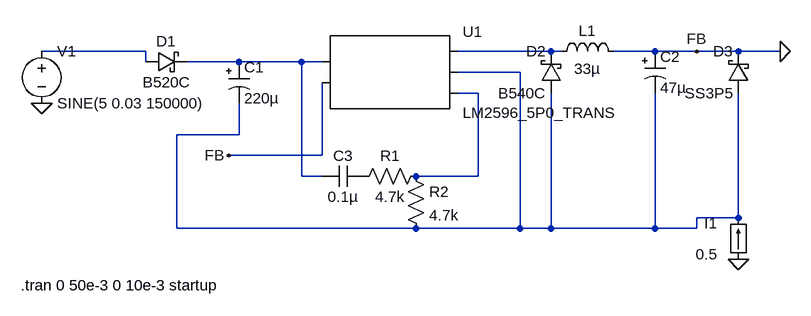
[diagram p0: schematic LM2596-N5.asc]
LM2596-N5.asc, the LTspice schematic file:
Version 4
SHEET 1 904 680
WIRE -176 128 -336 128
WIRE 448 128 304 128
WIRE 464 128 448 128
WIRE 608 128 544 128
WIRE 672 128 608 128
WIRE 736 128 672 128
WIRE 800 128 736 128
WIRE -176 144 -176 128
WIRE -32 144 -112 144
WIRE 64 144 -32 144
WIRE 96 144 64 144
WIRE -32 160 -32 144
WIRE 400 160 304 160
WIRE 336 192 304 192
WIRE -32 256 -32 208
WIRE -32 256 -128 256
WIRE 96 288 96 176
WIRE 96 288 -48 288
WIRE 64 320 64 144
WIRE 96 320 64 320
WIRE 336 320 336 192
WIRE 336 320 240 320
WIRE 736 384 736 192
WIRE 736 384 672 384
WIRE -128 400 -128 256
WIRE 240 400 -128 400
WIRE 400 400 400 160
WIRE 400 400 240 400
WIRE 448 400 448 192
WIRE 448 400 400 400
WIRE 608 400 608 192
WIRE 608 400 448 400
WIRE 672 400 672 384
WIRE 672 400 608 400
FLAG -336 208 0
FLAG 672 128 FB
FLAG -48 288 FB
FLAG 800 128 0
FLAG 736 448 0
SYMBOL AutoGenerated\\LM2596_5P0_TRANS 192 160 R0
SYMATTR InstName U1
SYMBOL voltage -336 112 R0
WINDOW 123 0 0 Left 2
WINDOW 39 0 0 Left 2
SYMATTR InstName V1
SYMATTR Value SINE(5 0.03 150000)
SYMBOL polcap -48 144 R0
WINDOW 3 24 56 Left 2
SYMATTR Value 220µ
SYMATTR InstName C1
SYMATTR Description Capacitor
SYMATTR Type cap
SYMATTR SpiceLine V=35 Irms=1.87845 Rser=0.07 Lser=0
SYMBOL ind 448 144 R270
WINDOW 0 32 56 VTop 2
WINDOW 3 5 56 VBottom 2
SYMATTR InstName L1
SYMATTR Value 33µ
SYMATTR SpiceLine Ipk=3.1 Rser=0.09 Rpar=29488.4 Cpar=0 mfg="Bourns, Inc." pn="SRR1206-330YL"
SYMBOL polcap 592 128 R0
WINDOW 3 24 56 Left 2
SYMATTR Value 47µ
SYMATTR InstName C2
SYMATTR Description Capacitor
SYMATTR Type cap
SYMATTR SpiceLine V=20 Irms=2 Rser=0.045 Lser=0
SYMBOL cap 160 304 R90
WINDOW 0 0 32 VBottom 2
WINDOW 3 32 32 VTop 2
SYMATTR InstName C3
SYMATTR Value 0.1µ
SYMATTR SpiceLine V=25 Irms=950m Rser=0.0765605 Lser=0 mfg="KEMET" pn="C2220C104K3RAC" type="X7R"
SYMBOL res 256 304 R90
WINDOW 0 0 56 VBottom 2
WINDOW 3 32 56 VTop 2
SYMATTR InstName R1
SYMATTR Value 4.7k
SYMATTR SpiceLine tol=1 pwr=0.1
SYMBOL res 224 304 R0
SYMATTR InstName R2
SYMATTR Value 4.7k
SYMBOL schottky -176 160 R270
WINDOW 0 32 32 VTop 2
WINDOW 3 0 32 VBottom 2
SYMATTR InstName D1
SYMATTR Value B520C
SYMATTR Description Diode
SYMATTR Type diode
SYMBOL schottky 464 192 R180
WINDOW 0 24 64 Left 2
WINDOW 3 24 0 Left 2
SYMATTR InstName D2
SYMATTR Value B540C
SYMATTR Description Diode
SYMATTR Type diode
SYMBOL schottky 752 192 R180
WINDOW 0 24 64 Left 2
WINDOW 3 24 0 Left 2
SYMATTR InstName D3
SYMATTR Value SS3P5
SYMATTR Description Diode
SYMATTR Type diode
SYMBOL load 752 448 R180
WINDOW 0 48 56 Left 2
WINDOW 3 48 8 Left 2
WINDOW 123 0 0 Left 2
WINDOW 39 0 0 Left 2
SYMATTR InstName I1
SYMATTR Value 0.5
TEXT -368 488 Left 2 !.tran 0 50e-3 0 10e-3 startup

The netlist it stands for:
* LM2596-N5.asc
* U1: LM2596_5P0_TRANS (symbol AutoGenerated\LM2596_5P0_TRANS not available, pins judged from their places): pin1=N003 pin2=0 pin3=N002 pin4=N004 pin5=N005
V1 N001 0 SINE(5 0.03 150000)
C1 N003 N004 220µ V=35 Irms=1.87845 Rser=0.07 Lser=0
L1 N002 0 33µ Ipk=3.1 Rser=0.09 Rpar=29488.4 Cpar=0 mfg="Bourns, Inc." pn="SRR1206-330YL"
C2 0 N004 47µ V=20 Irms=2 Rser=0.045 Lser=0
C3 P001 N003 0.1µ V=25 Irms=950m Rser=0.0765605 Lser=0 mfg="KEMET" pn="C2220C104K3RAC" type="X7R"
R1 N005 P001 4.7k tol=1 pwr=0.1
R2 N005 N004 4.7k
D1 N001 N003 B520C
D2 N004 N002 B540C
D3 N004 0 SS3P5
I1 0 N004 0.5
.model D D
.lib standard.dio
.tran 0 50e-3 0 10e-3 startup
.backanno
.end